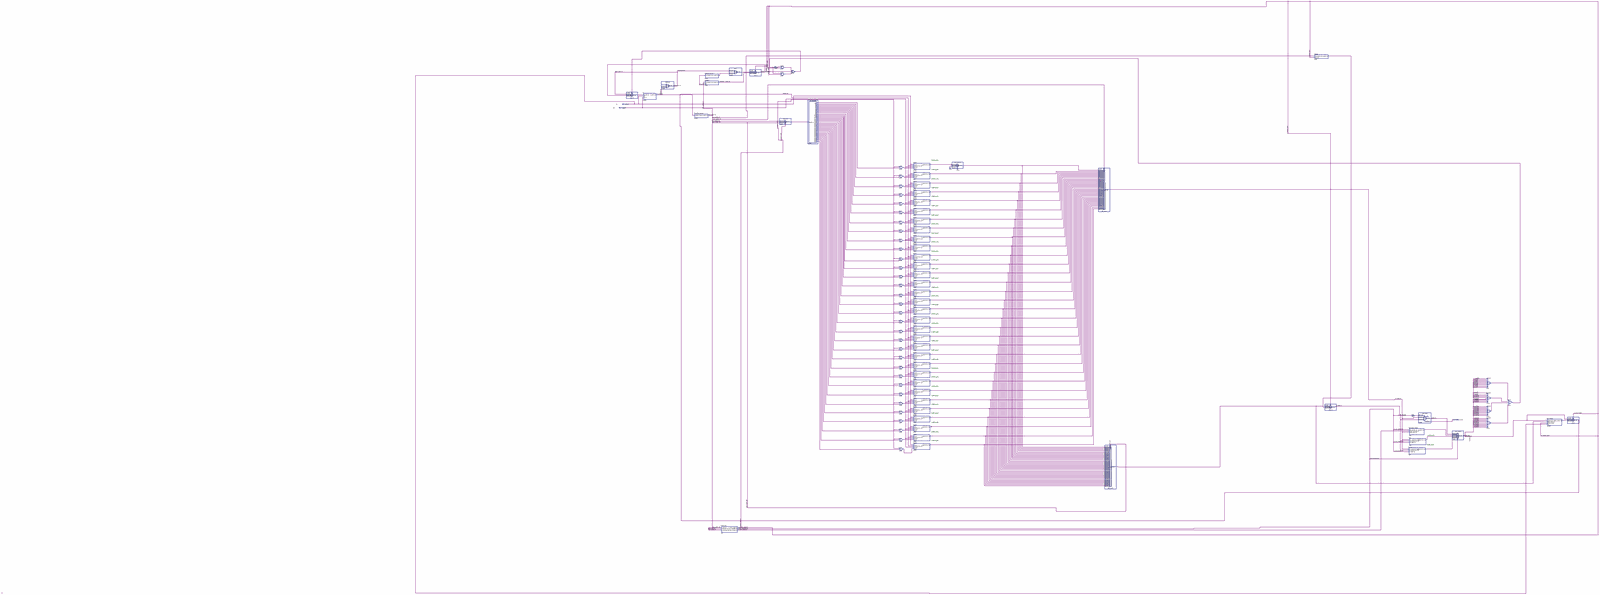
[diagram p0: schematic sheet, whole]
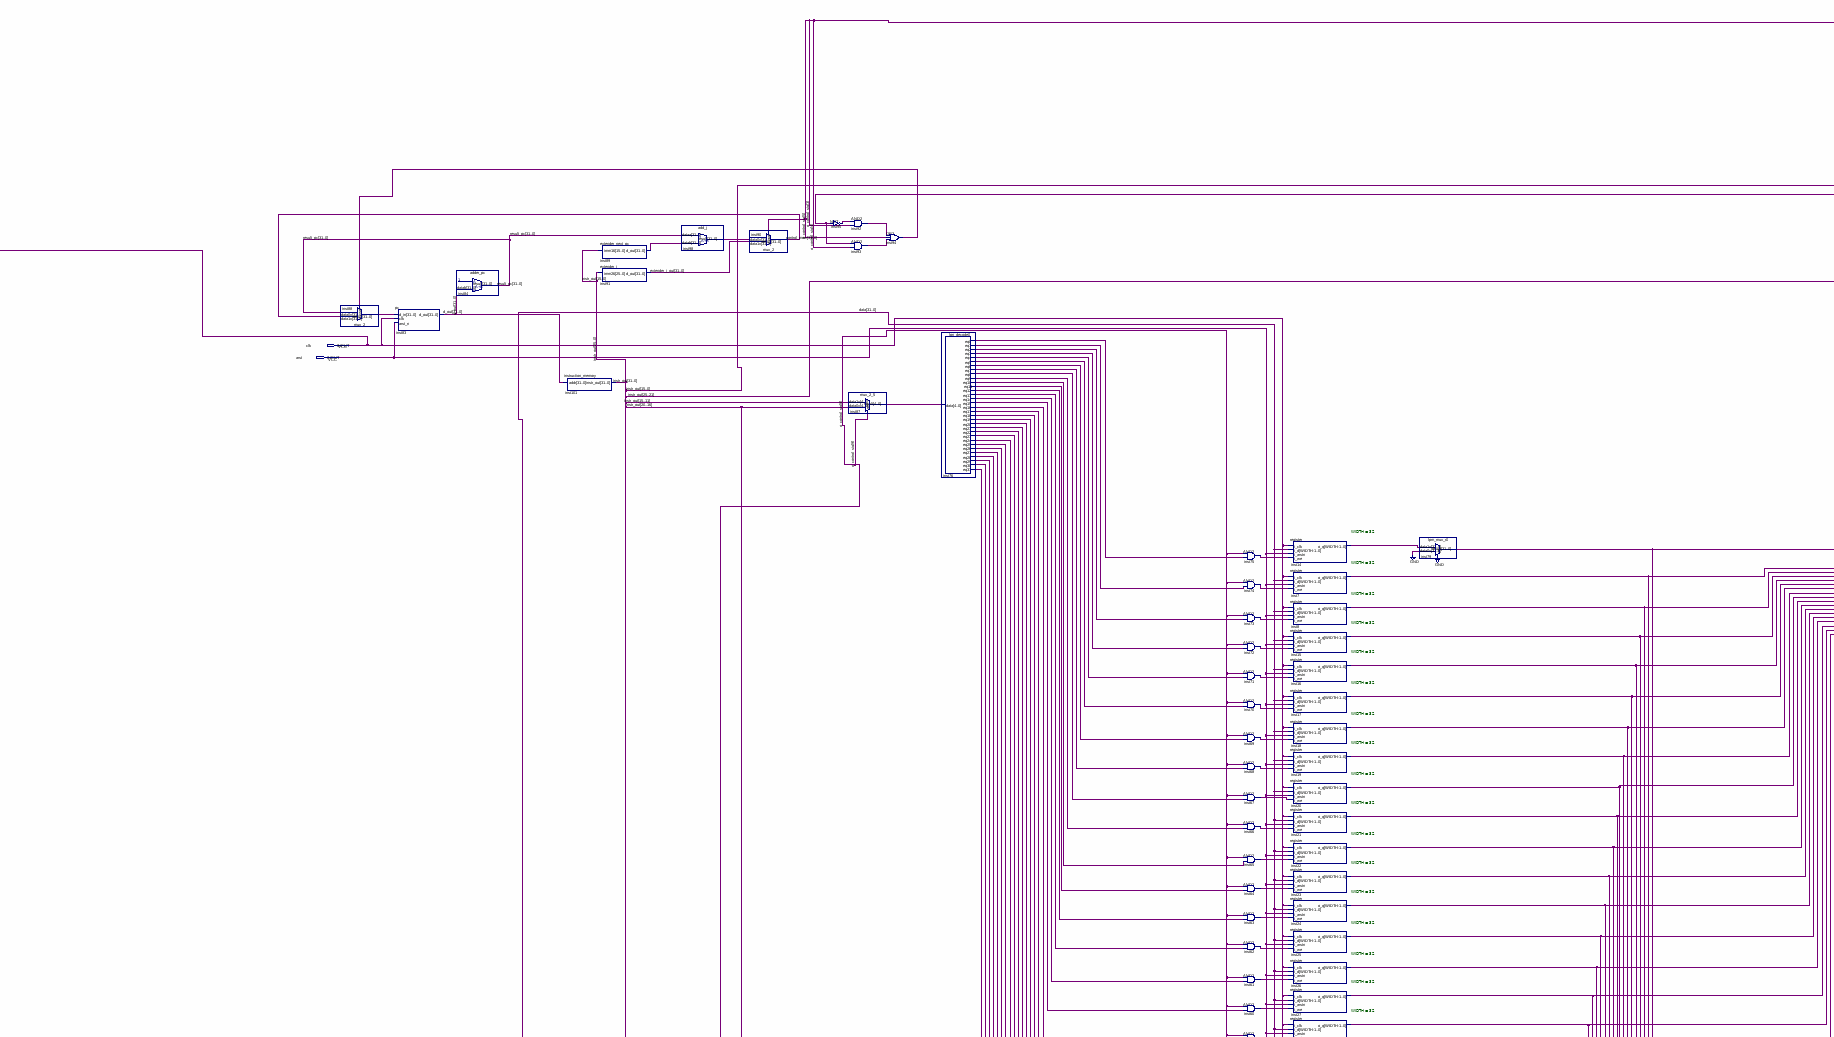
[diagram p1: schematic sheet, upper centre part]
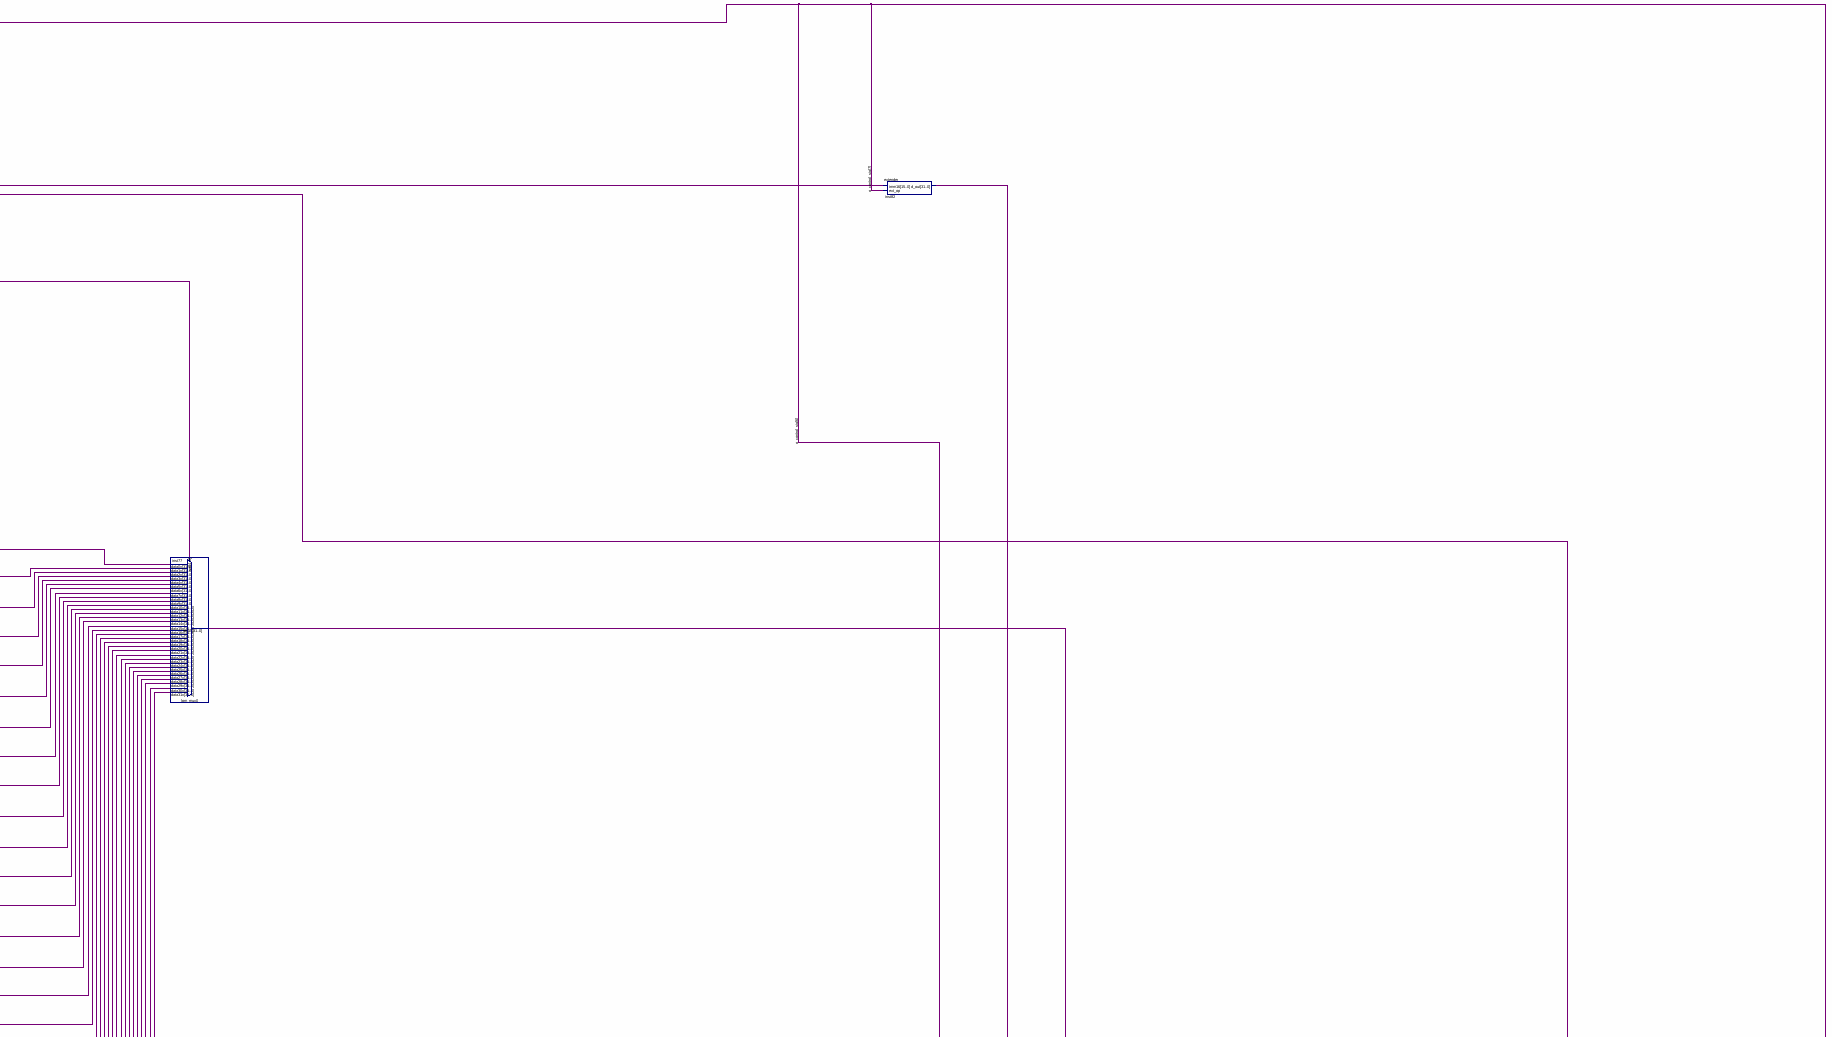
[diagram p2: schematic sheet, upper right part]
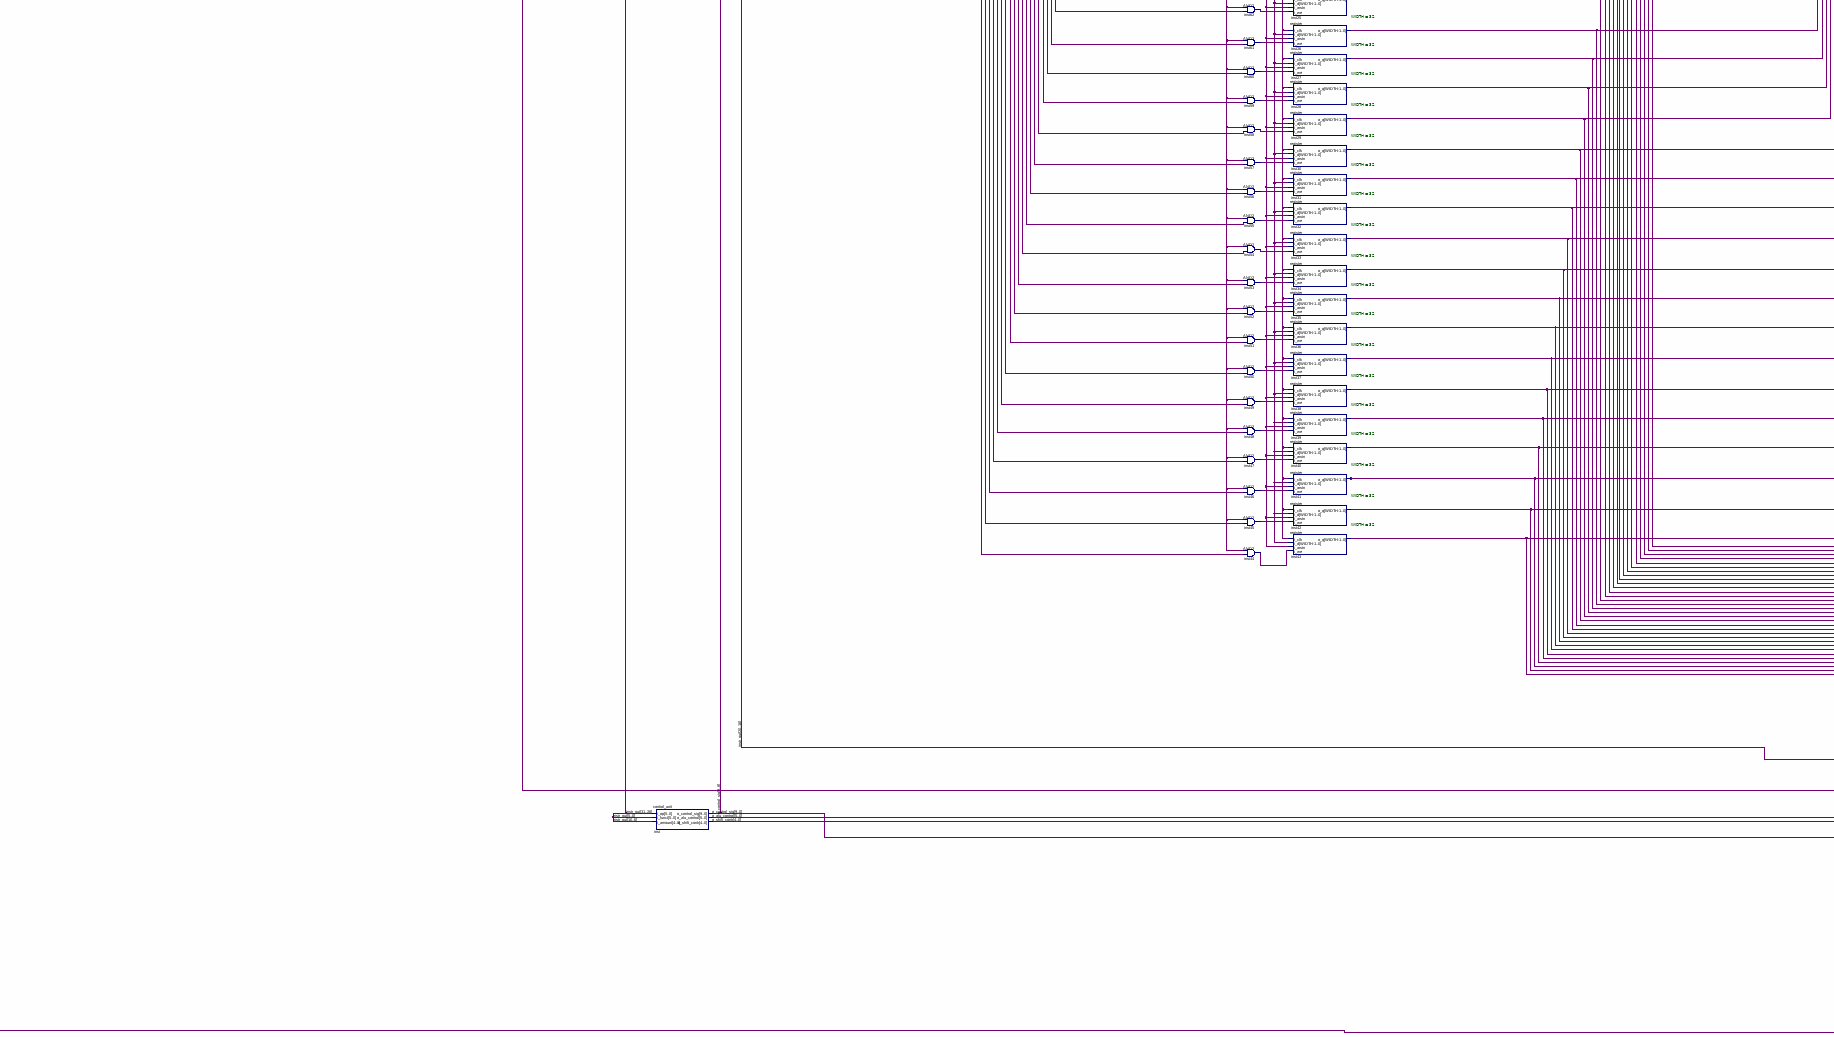
[diagram p3: schematic sheet, lower centre part]
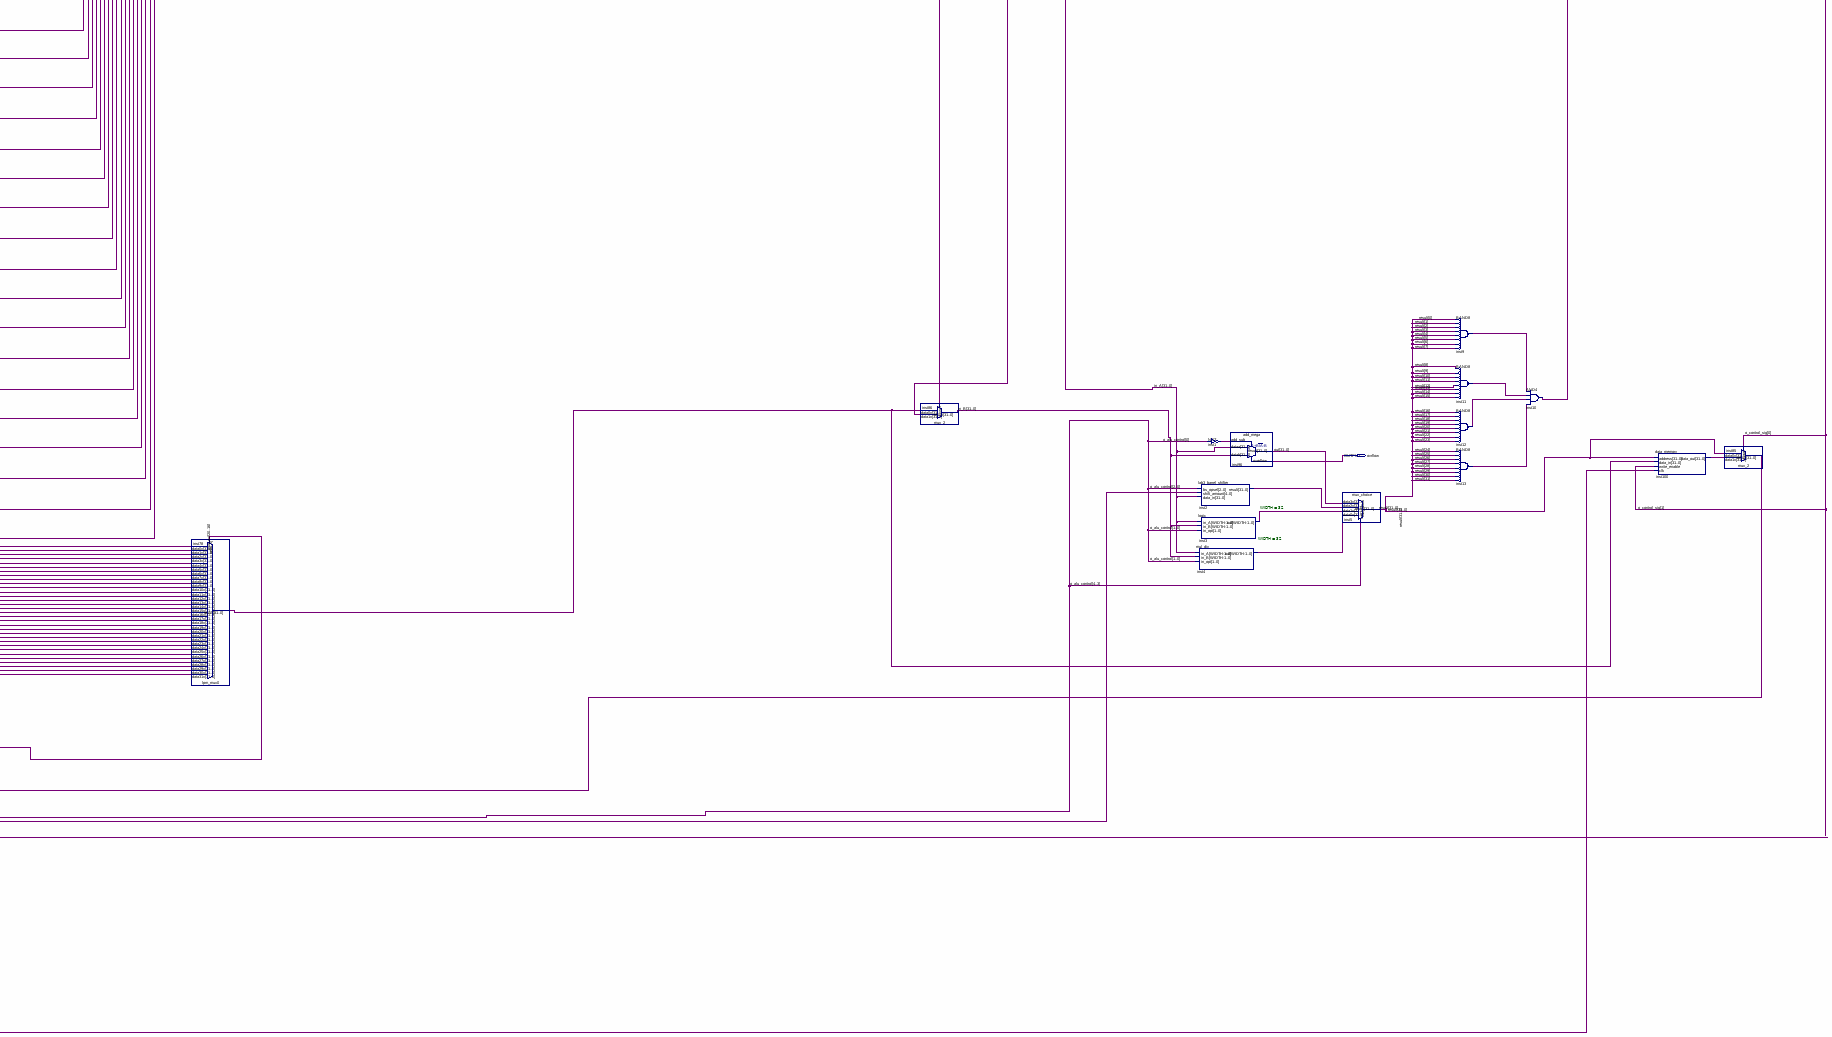
[diagram p4: schematic sheet, lower right part]
// Quartus schematic Block1.bdf as structural Verilog: 97 symbols, 3 pins
module Block1 (
  input  clk,
  input  arst,
  output ovrflow
);

  wire inst1_out, inst9_out, inst10_out, inst11_out, inst12_out, inst13_out, inst44_out, inst45_out,
       inst46_out, inst47_out, inst48_out, inst49_out, inst50_out, inst51_out, inst52_out, inst53_out,
       inst54_out, inst55_out, inst56_out, inst57_out, inst58_out, inst59_out, inst60_out, inst61_out,
       inst62_out, inst63_out, inst64_out, inst65_out, inst66_out, inst67_out, inst68_out, inst69_out,
       inst70_out, inst71_out, inst72_out, inst73_out, inst74_out, inst75_out, inst76_eq0, inst76_eq1,
       inst76_eq2, inst76_eq3, inst76_eq4, inst76_eq5, inst76_eq6, inst76_eq7, inst76_eq8, inst76_eq9,
       inst76_eq10, inst76_eq11, inst76_eq12, inst76_eq13, inst76_eq14, inst76_eq15, inst76_eq16,
       inst76_eq17, inst76_eq18, inst76_eq19, inst76_eq20, inst76_eq21, inst76_eq22, inst76_eq23,
       inst76_eq24, inst76_eq25, inst76_eq26, inst76_eq27, inst76_eq28, inst76_eq29, inst76_eq30,
       inst76_eq31, inst92_out, inst93_out, inst94_out, inst95_out;
  wire [4:0] inst87_result, o_shift_contr;
  wire [5:0] o_alu_control;
  wire [9:0] o_control_sig;
  wire [31:0] control_mem, d_out, data, extender_j_out, in_A, in_B, inst2_result, inst3_out, inst4_out,
       inst7_o_q, inst8_o_q, inst14_o_q, inst15_o_q, inst16_o_q, inst17_o_q, inst18_o_q, inst19_o_q,
       inst20_o_q, inst21_o_q, inst22_o_q, inst23_o_q, inst24_o_q, inst25_o_q, inst26_o_q, inst27_o_q,
       inst28_o_q, inst29_o_q, inst30_o_q, inst31_o_q, inst32_o_q, inst33_o_q, inst34_o_q, inst35_o_q,
       inst36_o_q, inst37_o_q, inst38_o_q, inst39_o_q, inst40_o_q, inst41_o_q, inst42_o_q, inst43_o_q,
       inst78_result, inst79_result, inst82_d_out, inst88_result, inst89_d_out, inst98_result,
       inst100_data_out, instr_out, out, result, result_pc;

  mux_2 inst88 (.data1x(control_mem), .data0x(result_pc), .sel(inst94_out), .result(inst88_result));
  pc inst83 (.d_in(inst88_result), .clk(clk), .arst_n(arst), .d_out(d_out));
  adder_pc inst84 (.datab(d_out), .result(result_pc));
  instruction_memory inst101 (.addr(d_out), .instr_out(instr_out));
  extender_next_pc inst89 (.imm16(instr_out[15:0]), .d_out(inst89_d_out));
  extender_j inst91 (.imm26(instr_out[25:0]), .d_out(extender_j_out));
  control_unit inst (
    .i_op(instr_out[31:26]), .i_funct(instr_out[5:0]), .i_amount(instr_out[10:6]),
    .o_control_sig(o_control_sig), .o_alu_control(o_alu_control), .o_shift_contr(o_shift_contr));
  add_j inst98 (.dataa(result_pc), .datab(inst89_d_out), .result(inst98_result));
  mux_2 inst90 (.data1x(extender_j_out), .data0x(inst98_result), .sel(o_control_sig[5]), .result(control_mem));
  not inst95 (inst95_out, inst10_out);
  and inst92 (inst92_out, inst95_out, o_control_sig[3]);
  and inst93 (inst93_out, inst10_out, o_control_sig[4]);
  mux_2_5 inst87 (.data1x(instr_out[15:11]), .data0x(instr_out[20:16]), .sel(o_control_sig[9]), .result(inst87_result));
  or inst94 (inst94_out, inst92_out, o_control_sig[5], inst93_out);
  lpn_decode0 inst76 (
    .data(inst87_result), .eq0(inst76_eq0), .eq1(inst76_eq1), .eq2(inst76_eq2), .eq3(inst76_eq3),
    .eq4(inst76_eq4), .eq5(inst76_eq5), .eq6(inst76_eq6), .eq7(inst76_eq7), .eq8(inst76_eq8),
    .eq9(inst76_eq9), .eq10(inst76_eq10), .eq11(inst76_eq11), .eq12(inst76_eq12), .eq13(inst76_eq13),
    .eq14(inst76_eq14), .eq15(inst76_eq15), .eq16(inst76_eq16), .eq17(inst76_eq17), .eq18(inst76_eq18),
    .eq19(inst76_eq19), .eq20(inst76_eq20), .eq21(inst76_eq21), .eq22(inst76_eq22), .eq23(inst76_eq23),
    .eq24(inst76_eq24), .eq25(inst76_eq25), .eq26(inst76_eq26), .eq27(inst76_eq27), .eq28(inst76_eq28),
    .eq29(inst76_eq29), .eq30(inst76_eq30), .eq31(inst76_eq31));
  and inst75 (inst75_out, o_control_sig[8], inst76_eq0);
  and inst74 (inst74_out, o_control_sig[8], inst76_eq1);
  and inst73 (inst73_out, o_control_sig[8], inst76_eq2);
  and inst72 (inst72_out, o_control_sig[8], inst76_eq3);
  and inst71 (inst71_out, o_control_sig[8], inst76_eq4);
  and inst70 (inst70_out, o_control_sig[8], inst76_eq5);
  and inst69 (inst69_out, o_control_sig[8], inst76_eq6);
  and inst68 (inst68_out, o_control_sig[8], inst76_eq7);
  and inst67 (inst67_out, o_control_sig[8], inst76_eq8);
  and inst66 (inst66_out, o_control_sig[8], inst76_eq9);
  and inst65 (inst65_out, o_control_sig[8], inst76_eq10);
  and inst64 (inst64_out, o_control_sig[8], inst76_eq11);
  and inst63 (inst63_out, o_control_sig[8], inst76_eq12);
  and inst62 (inst62_out, o_control_sig[8], inst76_eq13);
  and inst61 (inst61_out, o_control_sig[8], inst76_eq14);
  and inst60 (inst60_out, o_control_sig[8], inst76_eq15);
  and inst59 (inst59_out, o_control_sig[8], inst76_eq16);
  and inst58 (inst58_out, o_control_sig[8], inst76_eq17);
  and inst57 (inst57_out, o_control_sig[8], inst76_eq18);
  and inst56 (inst56_out, o_control_sig[8], inst76_eq19);
  and inst55 (inst55_out, o_control_sig[8], inst76_eq20);
  and inst54 (inst54_out, o_control_sig[8], inst76_eq21);
  and inst53 (inst53_out, o_control_sig[8], inst76_eq22);
  and inst52 (inst52_out, o_control_sig[8], inst76_eq23);
  and inst51 (inst51_out, o_control_sig[8], inst76_eq24);
  and inst50 (inst50_out, o_control_sig[8], inst76_eq25);
  and inst49 (inst49_out, o_control_sig[8], inst76_eq26);
  and inst48 (inst48_out, o_control_sig[8], inst76_eq27);
  and inst47 (inst47_out, o_control_sig[8], inst76_eq28);
  and inst46 (inst46_out, o_control_sig[8], inst76_eq29);
  and inst45 (inst45_out, o_control_sig[8], inst76_eq30);
  and inst44 (inst44_out, o_control_sig[8], inst76_eq31);
  register #(.WIDTH(32)) inst14 (.i_clk(clk), .i_d(data), .i_arstn(arst), .i_we(inst75_out), .o_q(inst14_o_q));
  register #(.WIDTH(32)) inst7 (.i_clk(clk), .i_d(data), .i_arstn(arst), .i_we(inst74_out), .o_q(inst7_o_q));
  register #(.WIDTH(32)) inst8 (.i_clk(clk), .i_d(data), .i_arstn(arst), .i_we(inst73_out), .o_q(inst8_o_q));
  register #(.WIDTH(32)) inst15 (.i_clk(clk), .i_d(data), .i_arstn(arst), .i_we(inst72_out), .o_q(inst15_o_q));
  register #(.WIDTH(32)) inst16 (.i_clk(clk), .i_d(data), .i_arstn(arst), .i_we(inst71_out), .o_q(inst16_o_q));
  register #(.WIDTH(32)) inst17 (.i_clk(clk), .i_d(data), .i_arstn(arst), .i_we(inst70_out), .o_q(inst17_o_q));
  register #(.WIDTH(32)) inst18 (.i_clk(clk), .i_d(data), .i_arstn(arst), .i_we(inst69_out), .o_q(inst18_o_q));
  register #(.WIDTH(32)) inst19 (.i_clk(clk), .i_d(data), .i_arstn(arst), .i_we(inst68_out), .o_q(inst19_o_q));
  register #(.WIDTH(32)) inst20 (.i_clk(clk), .i_d(data), .i_arstn(arst), .i_we(inst67_out), .o_q(inst20_o_q));
  register #(.WIDTH(32)) inst21 (.i_clk(clk), .i_d(data), .i_arstn(arst), .i_we(inst66_out), .o_q(inst21_o_q));
  register #(.WIDTH(32)) inst22 (.i_clk(clk), .i_d(data), .i_arstn(arst), .i_we(inst65_out), .o_q(inst22_o_q));
  register #(.WIDTH(32)) inst23 (.i_clk(clk), .i_d(data), .i_arstn(arst), .i_we(inst64_out), .o_q(inst23_o_q));
  register #(.WIDTH(32)) inst24 (.i_clk(clk), .i_d(data), .i_arstn(arst), .i_we(inst63_out), .o_q(inst24_o_q));
  register #(.WIDTH(32)) inst25 (.i_clk(clk), .i_d(data), .i_arstn(arst), .i_we(inst62_out), .o_q(inst25_o_q));
  register #(.WIDTH(32)) inst26 (.i_clk(clk), .i_d(data), .i_arstn(arst), .i_we(inst61_out), .o_q(inst26_o_q));
  register #(.WIDTH(32)) inst27 (.i_clk(clk), .i_d(data), .i_arstn(arst), .i_we(inst60_out), .o_q(inst27_o_q));
  register #(.WIDTH(32)) inst28 (.i_clk(clk), .i_d(data), .i_arstn(arst), .i_we(inst59_out), .o_q(inst28_o_q));
  register #(.WIDTH(32)) inst29 (.i_clk(clk), .i_d(data), .i_arstn(arst), .i_we(inst58_out), .o_q(inst29_o_q));
  register #(.WIDTH(32)) inst30 (.i_clk(clk), .i_d(data), .i_arstn(arst), .i_we(inst57_out), .o_q(inst30_o_q));
  register #(.WIDTH(32)) inst31 (.i_clk(clk), .i_d(data), .i_arstn(arst), .i_we(inst56_out), .o_q(inst31_o_q));
  register #(.WIDTH(32)) inst32 (.i_clk(clk), .i_d(data), .i_arstn(arst), .i_we(inst55_out), .o_q(inst32_o_q));
  register #(.WIDTH(32)) inst33 (.i_clk(clk), .i_d(data), .i_arstn(arst), .i_we(inst54_out), .o_q(inst33_o_q));
  register #(.WIDTH(32)) inst34 (.i_clk(clk), .i_d(data), .i_arstn(arst), .i_we(inst53_out), .o_q(inst34_o_q));
  register #(.WIDTH(32)) inst35 (.i_clk(clk), .i_d(data), .i_arstn(arst), .i_we(inst52_out), .o_q(inst35_o_q));
  register #(.WIDTH(32)) inst36 (.i_clk(clk), .i_d(data), .i_arstn(arst), .i_we(inst51_out), .o_q(inst36_o_q));
  register #(.WIDTH(32)) inst37 (.i_clk(clk), .i_d(data), .i_arstn(arst), .i_we(inst50_out), .o_q(inst37_o_q));
  register #(.WIDTH(32)) inst38 (.i_clk(clk), .i_d(data), .i_arstn(arst), .i_we(inst49_out), .o_q(inst38_o_q));
  register #(.WIDTH(32)) inst39 (.i_clk(clk), .i_d(data), .i_arstn(arst), .i_we(inst48_out), .o_q(inst39_o_q));
  register #(.WIDTH(32)) inst40 (.i_clk(clk), .i_d(data), .i_arstn(arst), .i_we(inst47_out), .o_q(inst40_o_q));
  register #(.WIDTH(32)) inst41 (.i_clk(clk), .i_d(data), .i_arstn(arst), .i_we(inst46_out), .o_q(inst41_o_q));
  register #(.WIDTH(32)) inst42 (.i_clk(clk), .i_d(data), .i_arstn(arst), .i_we(inst45_out), .o_q(inst42_o_q));
  register #(.WIDTH(32)) inst43 (.i_clk(clk), .i_d(data), .i_arstn(arst), .i_we(inst44_out), .o_q(inst43_o_q));
  lpm_mux_r0 inst79 (.data1x(inst14_o_q), .data0x({32{1'b0}}), .sel(1'b0), .result(inst79_result));
  lpm_mux0 inst77 (
    .data31x(inst43_o_q), .data30x(inst42_o_q), .data29x(inst41_o_q), .data28x(inst40_o_q),
    .data27x(inst39_o_q), .data26x(inst38_o_q), .data25x(inst37_o_q), .data24x(inst36_o_q),
    .data23x(inst35_o_q), .data22x(inst34_o_q), .data21x(inst33_o_q), .data20x(inst32_o_q),
    .data19x(inst31_o_q), .data18x(inst30_o_q), .data17x(inst29_o_q), .data16x(inst28_o_q),
    .data15x(inst27_o_q), .data14x(inst26_o_q), .data13x(inst25_o_q), .data12x(inst24_o_q),
    .data11x(inst23_o_q), .data10x(inst22_o_q), .data9x(inst21_o_q), .data8x(inst20_o_q),
    .data7x(inst19_o_q), .data6x(inst18_o_q), .data5x(inst17_o_q), .data4x(inst16_o_q), .data3x(inst15_o_q),
    .data2x(inst8_o_q), .data1x(inst7_o_q), .data0x(inst79_result), .sel(instr_out[25:21]), .result(in_A));
  lpm_mux0 inst78 (
    .data31x(inst43_o_q), .data30x(inst42_o_q), .data29x(inst41_o_q), .data28x(inst40_o_q),
    .data27x(inst39_o_q), .data26x(inst38_o_q), .data25x(inst37_o_q), .data24x(inst36_o_q),
    .data23x(inst35_o_q), .data22x(inst34_o_q), .data21x(inst33_o_q), .data20x(inst32_o_q),
    .data19x(inst31_o_q), .data18x(inst30_o_q), .data17x(inst29_o_q), .data16x(inst28_o_q),
    .data15x(inst27_o_q), .data14x(inst26_o_q), .data13x(inst25_o_q), .data12x(inst24_o_q),
    .data11x(inst23_o_q), .data10x(inst22_o_q), .data9x(inst21_o_q), .data8x(inst20_o_q),
    .data7x(inst19_o_q), .data6x(inst18_o_q), .data5x(inst17_o_q), .data4x(inst16_o_q), .data3x(inst15_o_q),
    .data2x(inst8_o_q), .data1x(inst7_o_q), .data0x(inst79_result), .sel(instr_out[20:16]),
    .result(inst78_result));
  extender inst82 (.imm16(instr_out[15:0]), .ext_op(o_control_sig[7]), .d_out(inst82_d_out));
  mux_2 inst86 (.data1x(inst82_d_out), .data0x(inst78_result), .sel(o_control_sig[6]), .result(in_B));
  not inst1 (inst1_out, o_alu_control[0]);
  lab3_barrel_shifter inst2 (
    .bs_opsel(o_alu_control[2:0]), .shift_amount(o_shift_contr), .data_in(in_A), .result(inst2_result));
  \logic  #(.WIDTH(32)) inst3 (.in_A(in_A), .in_B(in_B), .in_opt(o_alu_control[1:0]), .out(inst3_out));
  mul_div #(.WIDTH(32)) inst4 (.in_A(in_A), .in_B(in_B), .in_opt(o_alu_control[1:0]), .out(inst4_out));
  add_mega inst96 (.add_sub(inst1_out), .dataa(in_A), .datab(in_B), .result(out), .overflow(ovrflow));
  mux_choice inst5 (
    .data3x(out), .data2x(inst2_result), .data1x(inst3_out), .data0x(inst4_out), .sel(o_alu_control[4:3]),
    .result(result));
  and inst9 (inst9_out, ~result[0], ~result[1], ~result[2], ~result[3], ~result[4], ~result[5], ~result[6], ~result[7]);  // BAND8
  and inst11 (inst11_out, ~result[8], ~result[9], ~result[10], ~result[11], ~result[12], ~result[13], ~result[14], ~result[15]);  // BAND8
  and inst12 (inst12_out, ~result[16], ~result[17], ~result[18], ~result[19], ~result[20], ~result[21], ~result[22], ~result[23]);  // BAND8
  and inst13 (inst13_out, ~result[24], ~result[25], ~result[26], ~result[27], ~result[28], ~result[29], ~result[30], ~result[31]);  // BAND8
  and inst10 (inst10_out, inst9_out, inst11_out, inst12_out, inst13_out);
  data_memory inst100 (
    .address(result), .data_in(inst78_result), .write_enable(o_control_sig[1]), .clk(clk),
    .data_out(inst100_data_out));
  mux_2 inst85 (.data1x(inst100_data_out), .data0x(result), .sel(o_control_sig[0]), .result(data));
endmodule
